# EAGLE design PowerSystem (EAGLE 7.2.0)

## Sheet 1 of 5
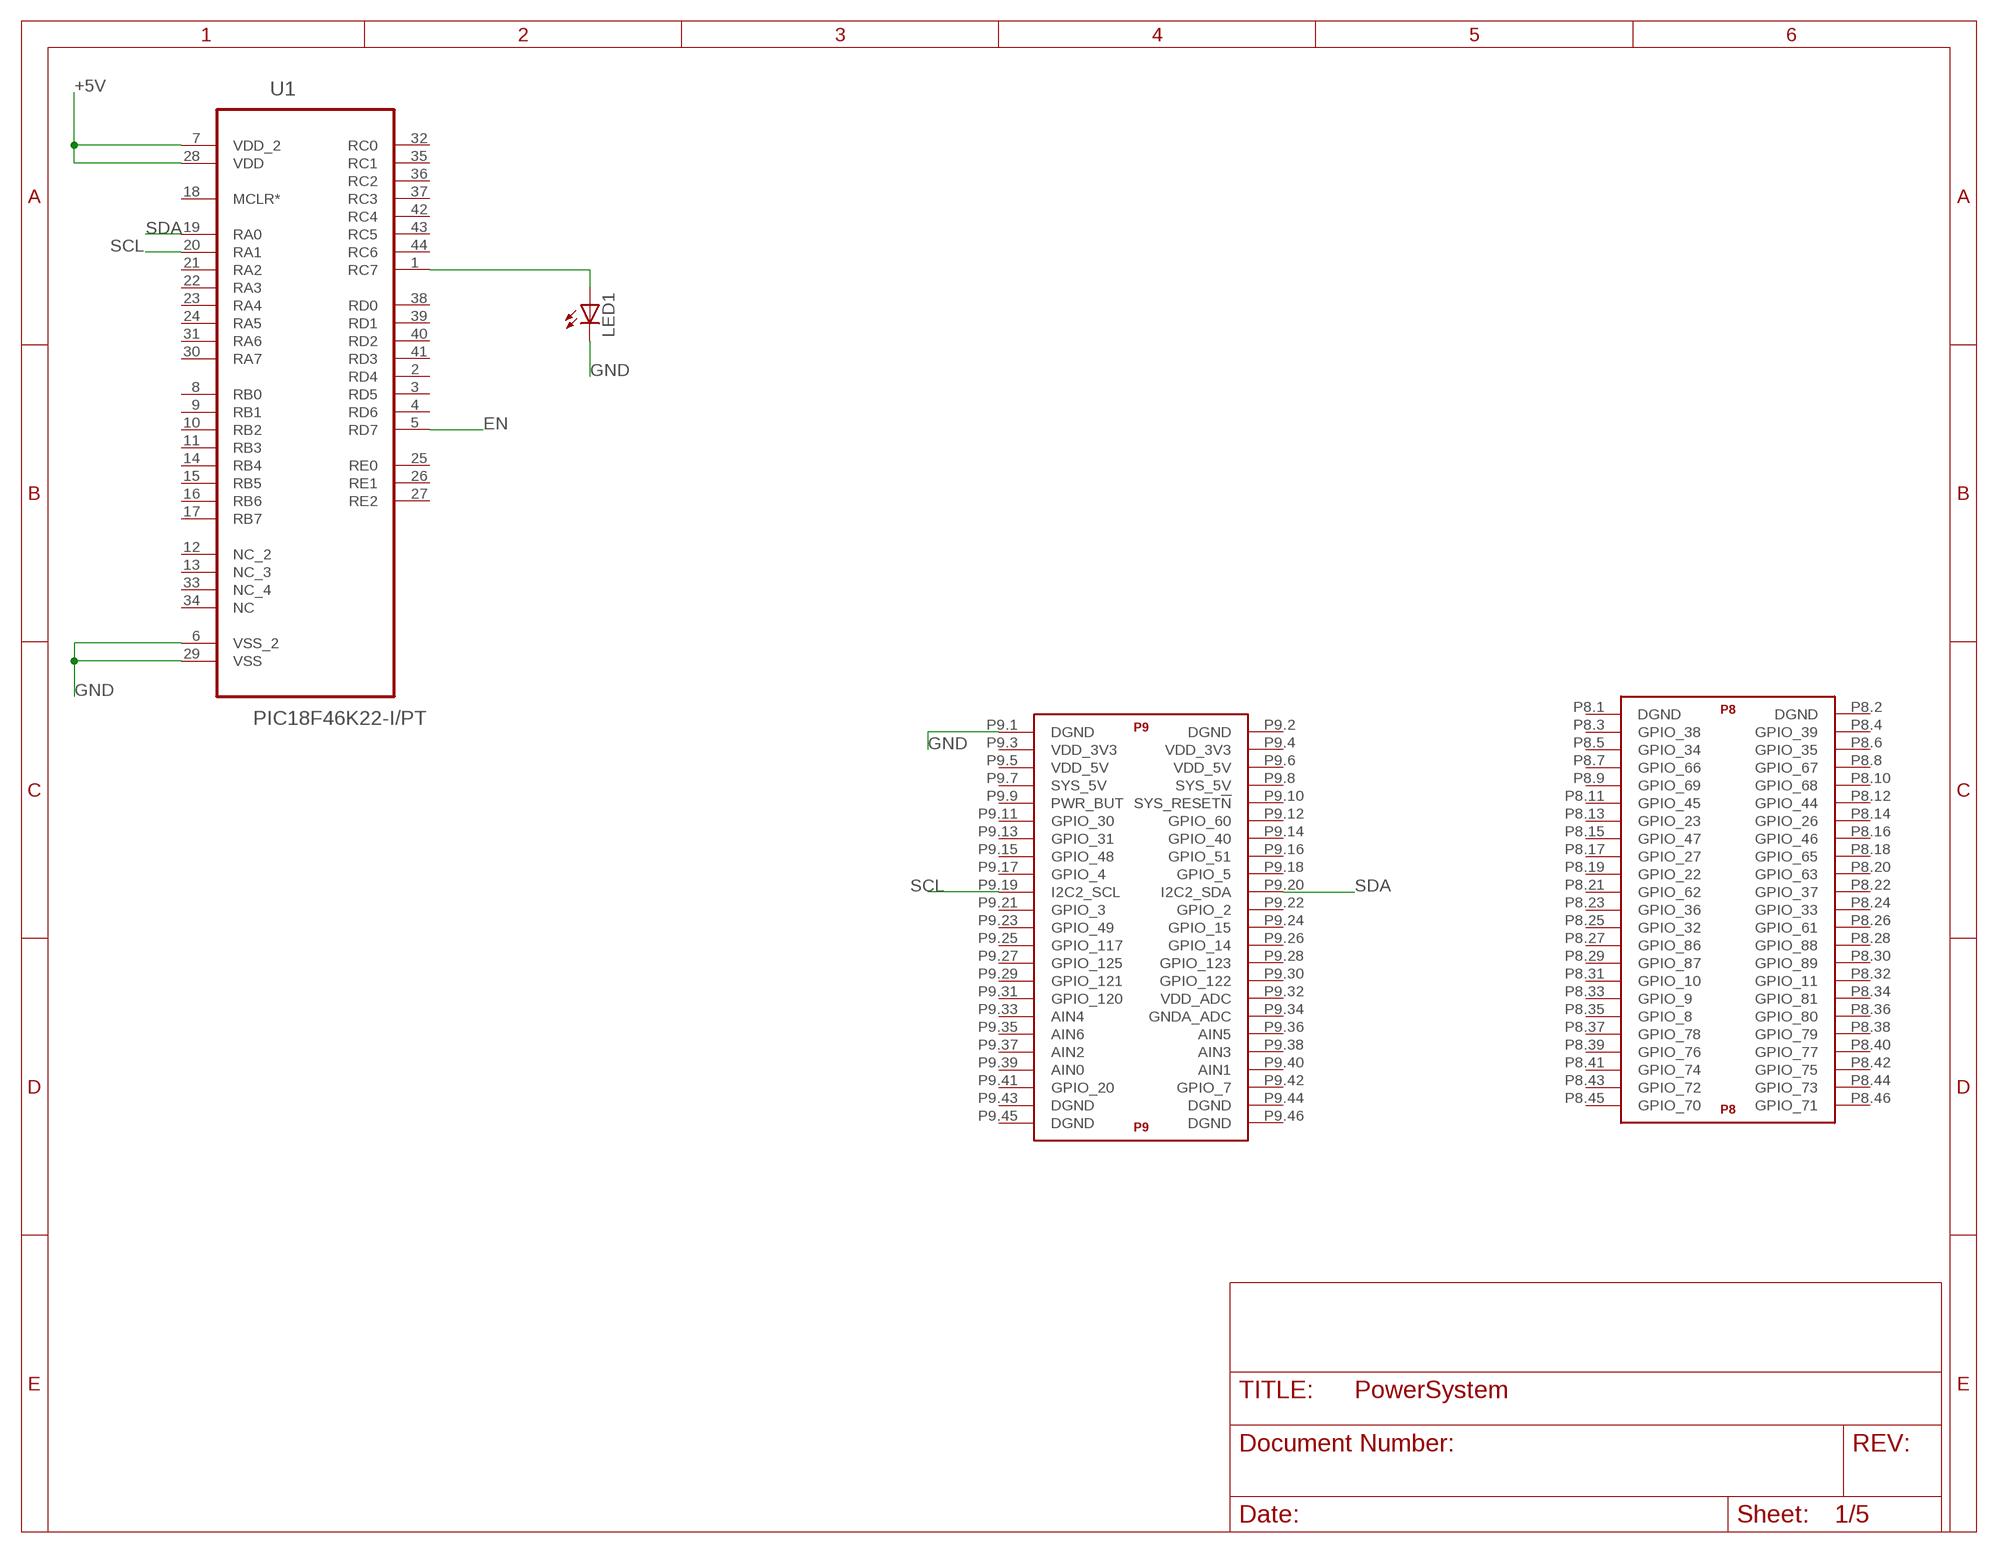
[diagram p0: schematic, sheet 1]

### Parts
LED1  LED  [SMARTLED-TTW]
U1  PIC18F46K22-I/PT  [QFP80P1200X1200X120-44N]
U$1  BEAGLE_BONE_BLACK_CAPE  [BEAGLE_BONE_BLACK_CAPE]

### Nets
+5V: U1.7(VDD_2) U1.28(VDD) ; also sheet 2
EN: U1.5(RD7) ; also sheet 4
GND: LED1.C@1(C) U1.6(VSS_2) U1.29(VSS) U$1.P9.1(P9:DGND) ; also sheet 2,4
N$5: LED1.A@1(A) U1.1(RC7)
SCL: U1.20(RA1) U$1.P9.19(P9:I2C2_SCL)
SDA: U1.19(RA0) U$1.P9.20(P9:I2C2_SDA)
Unconnected: U1.2(RD4) U1.3(RD5) U1.4(RD6) U1.8(RB0) U1.9(RB1) U1.10(RB2) U1.11(RB3) U1.12(NC_2) U1.13(NC_3) U1.14(RB4) U1.15(RB5) U1.16(RB6) U1.17(RB7) U1.18(MCLR*) U1.21(RA2) U1.22(RA3) U1.23(RA4) U1.24(RA5) U1.25(RE0) U1.26(RE1) U1.27(RE2) U1.30(RA7) U1.31(RA6) U1.32(RC0) U1.33(NC_4) U1.34(NC) U1.35(RC1) U1.36(RC2) U1.37(RC3) U1.38(RD0) U1.39(RD1) U1.40(RD2) U1.41(RD3) U1.42(RC4) U1.43(RC5) U1.44(RC6) U$1.P8.1(P8:DGND) U$1.P8.2(P8:DGND) U$1.P8.3(P8:GPIO_38) U$1.P8.4(P8:GPIO_39) U$1.P8.5(P8:GPIO_34) U$1.P8.6(P8:GPIO_35) U$1.P8.7(P8:GPIO_66) U$1.P8.8(P8:GPIO_67) U$1.P8.9(P8:GPIO_69) U$1.P8.10(P8:GPIO_68) U$1.P8.11(P8:GPIO_45) U$1.P8.12(P8:GPIO_44) U$1.P8.13(P8:GPIO_23) U$1.P8.14(P8:GPIO_26) U$1.P8.15(P8:GPIO_47) U$1.P8.16(P8:GPIO_46) U$1.P8.17(P8:GPIO_27) U$1.P8.18(P8:GPIO_65) U$1.P8.19(P8:GPIO_22) U$1.P8.20(P8:GPIO_63) U$1.P8.21(P8:GPIO_62) U$1.P8.22(P8:GPIO_37) U$1.P8.23(P8:GPIO_36) U$1.P8.24(P8:GPIO_33) U$1.P8.25(P8:GPIO_32) U$1.P8.26(P8:GPIO_61) U$1.P8.27(P8:GPIO_86) U$1.P8.28(P8:GPIO_88) U$1.P8.29(P8:GPIO_87) U$1.P8.30(P8:GPIO_89) U$1.P8.31(P8:GPIO_10) U$1.P8.32(P8:GPIO_11) U$1.P8.33(P8:GPIO_9) U$1.P8.34(P8:GPIO_81) U$1.P8.35(P8:GPIO_8) U$1.P8.36(P8:GPIO_80) U$1.P8.37(P8:GPIO_78) U$1.P8.38(P8:GPIO_79) U$1.P8.39(P8:GPIO_76) U$1.P8.40(P8:GPIO_77) U$1.P8.41(P8:GPIO_74) U$1.P8.42(P8:GPIO_75) U$1.P8.43(P8:GPIO_72) U$1.P8.44(P8:GPIO_73) U$1.P8.45(P8:GPIO_70) U$1.P8.46(P8:GPIO_71) U$1.P9.2(P9:DGND) U$1.P9.3(P9:VDD_3V3) U$1.P9.4(P9:VDD_3V3) U$1.P9.5(P9:VDD_5V) U$1.P9.6(P9:VDD_5V) U$1.P9.7(P9:SYS_5V) U$1.P9.8(P9:SYS_5V) U$1.P9.9(P9:PWR_BUT) U$1.P9.10(P9:SYS_RESET!N) U$1.P9.11(P9:GPIO_30) U$1.P9.12(P9:GPIO_60) U$1.P9.13(P9:GPIO_31) U$1.P9.14(P9:GPIO_40) U$1.P9.15(P9:GPIO_48) U$1.P9.16(P9:GPIO_51) U$1.P9.17(P9:GPIO_4) U$1.P9.18(P9:GPIO_5) U$1.P9.21(P9:GPIO_3) U$1.P9.22(P9:GPIO_2) U$1.P9.23(P9:GPIO_49) U$1.P9.24(P9:GPIO_15) U$1.P9.25(P9:GPIO_117) U$1.P9.26(P9:GPIO_14) U$1.P9.27(P9:GPIO_125) U$1.P9.28(P9:GPIO_123) U$1.P9.29(P9:GPIO_121) U$1.P9.30(P9:GPIO_122) U$1.P9.31(P9:GPIO_120) U$1.P9.32(P9:VDD_ADC) U$1.P9.33(P9:AIN4) U$1.P9.34(P9:GNDA_ADC) U$1.P9.35(P9:AIN6) U$1.P9.36(P9:AIN5) U$1.P9.37(P9:AIN2) U$1.P9.38(P9:AIN3) U$1.P9.39(P9:AIN0) U$1.P9.40(P9:AIN1) U$1.P9.41(P9:GPIO_20) U$1.P9.42(P9:GPIO_7) U$1.P9.43(P9:DGND) U$1.P9.44(P9:DGND) U$1.P9.45(P9:DGND) U$1.P9.46(P9:DGND)

## Sheet 2 of 5
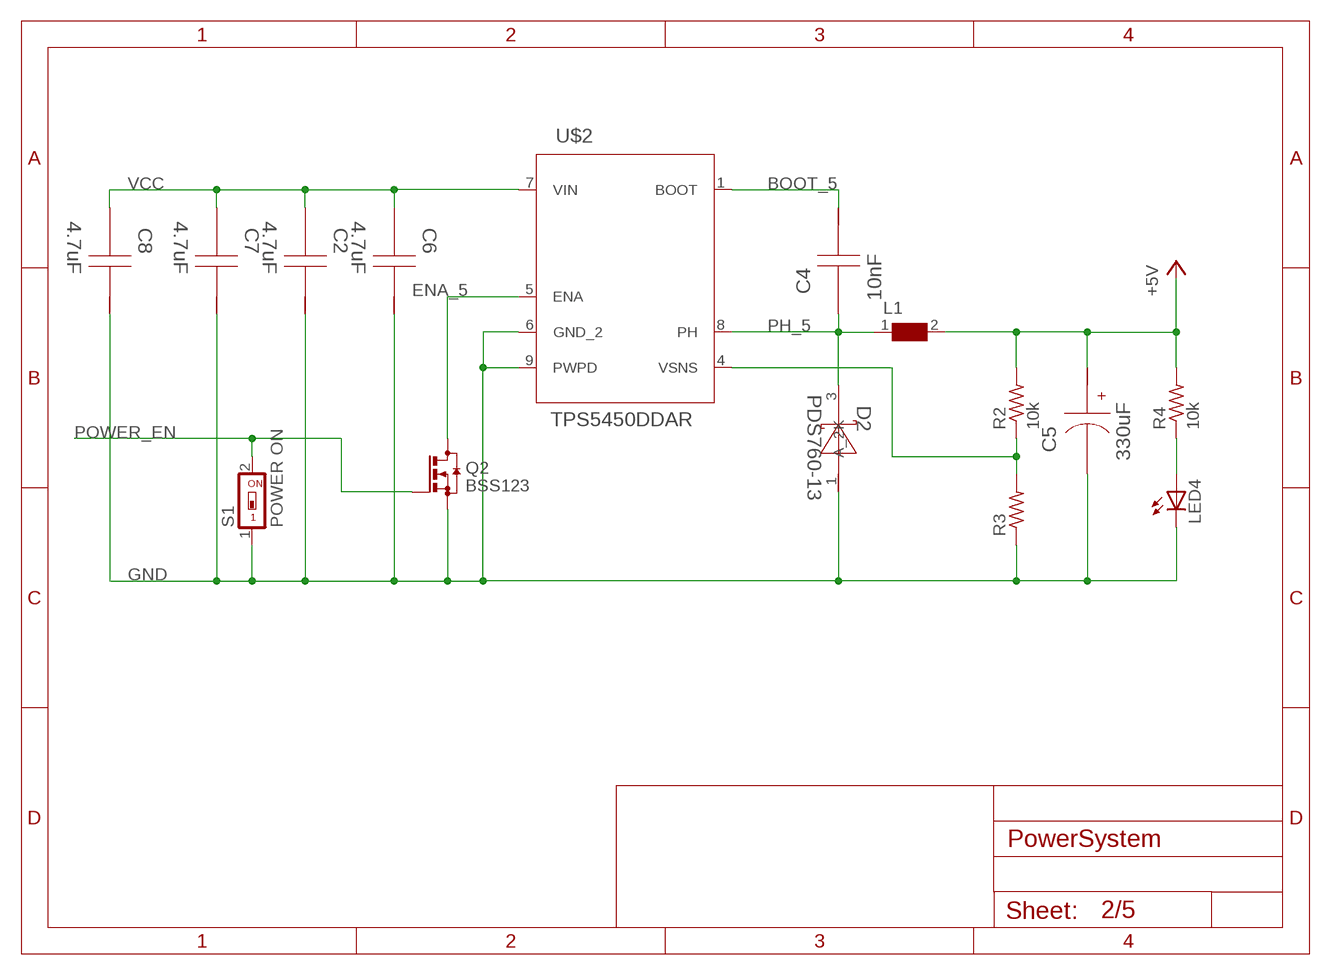
[diagram p1: schematic, sheet 2]

### Parts
C2  4.7uF  GRM31CR71H475KA12L  [1206]
C4  10nF  C0805C103K5RACTU  [0805]
C5  330uF  10SVP330MX  [SM_RADIAL_10AMM]
C6  4.7uF  GRM31CR71H475KA12L  [1206]
C7  4.7uF  GRM31CR71H475KA12L  [1206]
C8  4.7uF  GRM31CR71H475KA12L  [1206]
D2  PDS760-13  [POWERDI5]
L1  WE-HCC-7443331000_1090  [WE-HCC_1090]
LED4  LEDSML1206  [SML1206]
Q2  BSS123  [SOT23]
R2  10k  R-US_R1206  [R1206]
R3  R-US_R1206  [R1206]
R4  10k  R-US_R1206  [R1206]
S1  POWER ON  SWS001  [SMS-001]
U$2  TPS5450DDAR  [R-PDSO-G8]

### Nets
+5V: C5.1(+) L1.2 R2.2 R4.2 ; also sheet 1
BOOT_5: C4.1 U$2.1(BOOT)
ENA_5: Q2.3(D) U$2.5(ENA)
GND: C2.1 C5.2(-) C6.1 C7.1 C8.1 D2.1(A_2) LED4.C Q2.2(S) R3.1 S1.1 U$2.6(GND_2) U$2.9(PWPD) ; also sheet 1,4
N$2: LED4.A R4.1
PH_5: C4.2 D2.3(K) L1.1 U$2.8(PH)
POWER_EN: Q2.1(G) S1.2
VCC: C2.2 C6.2 C7.2 C8.2 U$2.7(VIN) ; also sheet 4
VSNS_5: R2.1 R3.2 U$2.4(VSNS)

## Sheet 3 of 5
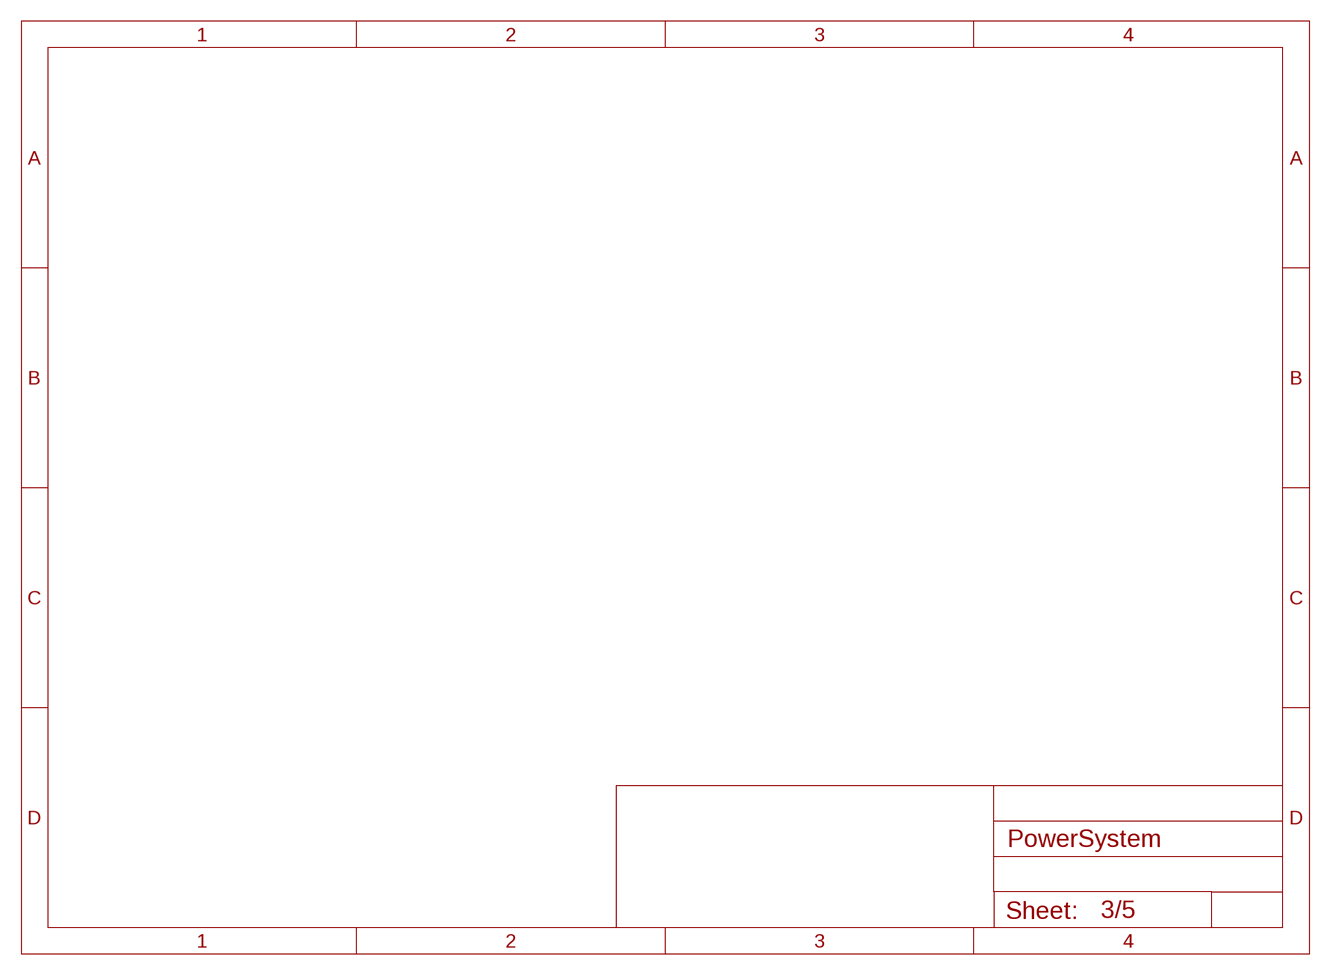
[diagram p2: schematic, sheet 3]

## Sheet 4 of 5
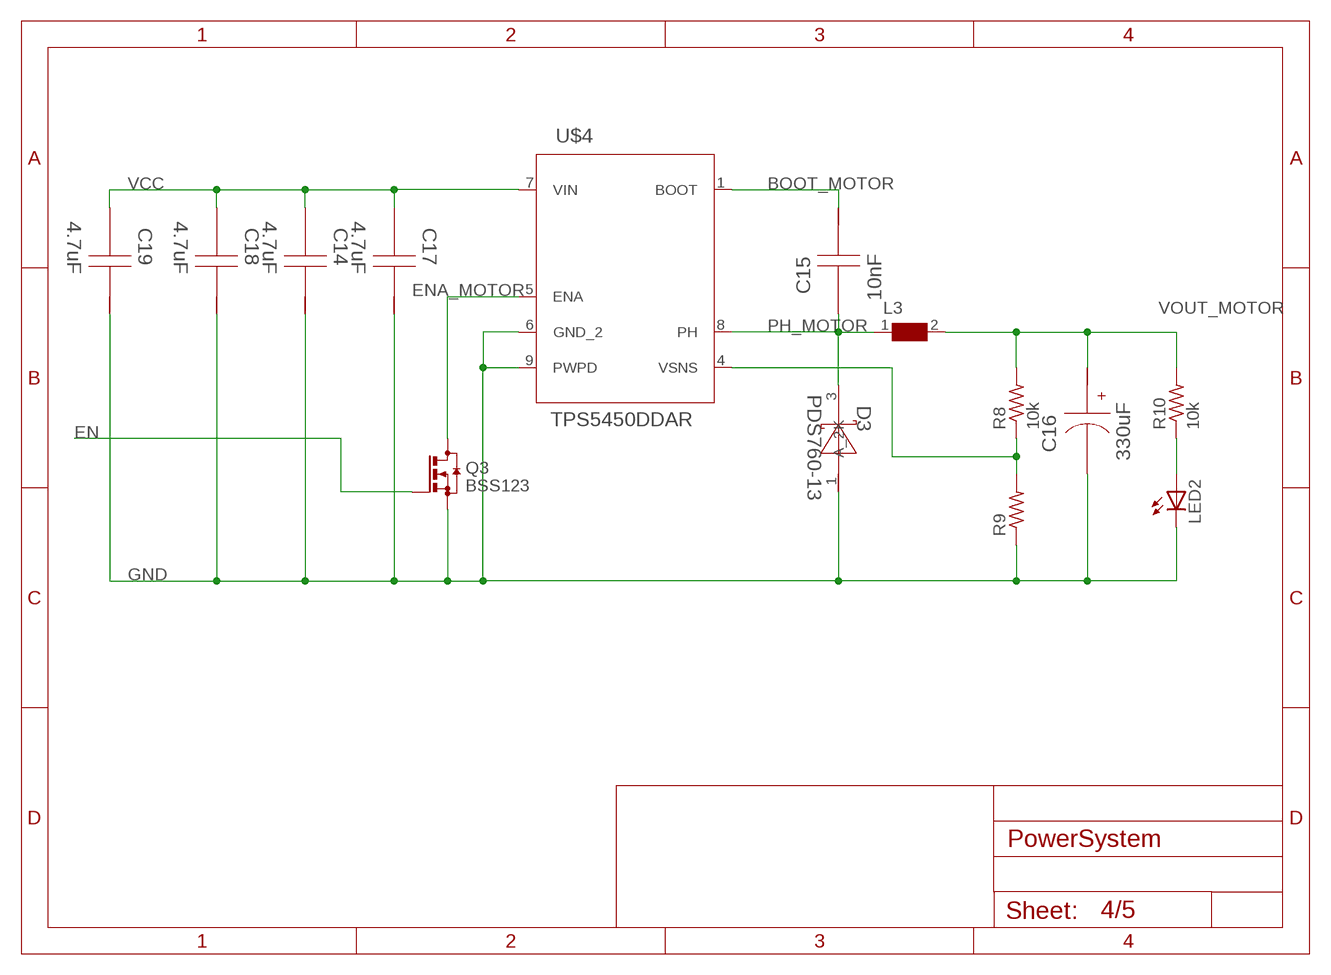
[diagram p3: schematic, sheet 4]

### Parts
C14  4.7uF  GRM31CR71H475KA12L  [1206]
C15  10nF  C0805C103K5RACTU  [0805]
C16  330uF  10SVP330MX  [SM_RADIAL_10AMM]
C17  4.7uF  GRM31CR71H475KA12L  [1206]
C18  4.7uF  GRM31CR71H475KA12L  [1206]
C19  4.7uF  GRM31CR71H475KA12L  [1206]
D3  PDS760-13  [POWERDI5]
L3  WE-HCC-7443331000_1090  [WE-HCC_1090]
LED2  LEDSML1206  [SML1206]
Q3  BSS123  [SOT23]
R8  10k  R-US_R1206  [R1206]
R9  R-US_R1206  [R1206]
R10  10k  R-US_R1206  [R1206]
U$4  TPS5450DDAR  [R-PDSO-G8]

### Nets
BOOT_MOTOR: C15.1 U$4.1(BOOT)
EN: Q3.1(G) ; also sheet 1
ENA_MOTOR: Q3.3(D) U$4.5(ENA)
GND: C14.1 C16.2(-) C17.1 C18.1 C19.1 D3.1(A_2) LED2.C Q3.2(S) R9.1 U$4.6(GND_2) U$4.9(PWPD) ; also sheet 1,2
N$4: LED2.A R10.1
PH_MOTOR: C15.2 D3.3(K) L3.1 U$4.8(PH)
VCC: C14.2 C17.2 C18.2 C19.2 U$4.7(VIN) ; also sheet 2
VOUT_MOTOR: C16.1(+) L3.2 R8.2 R10.2
VSNS1_MOTOR: R8.1 R9.2 U$4.4(VSNS)

## Sheet 5 of 5
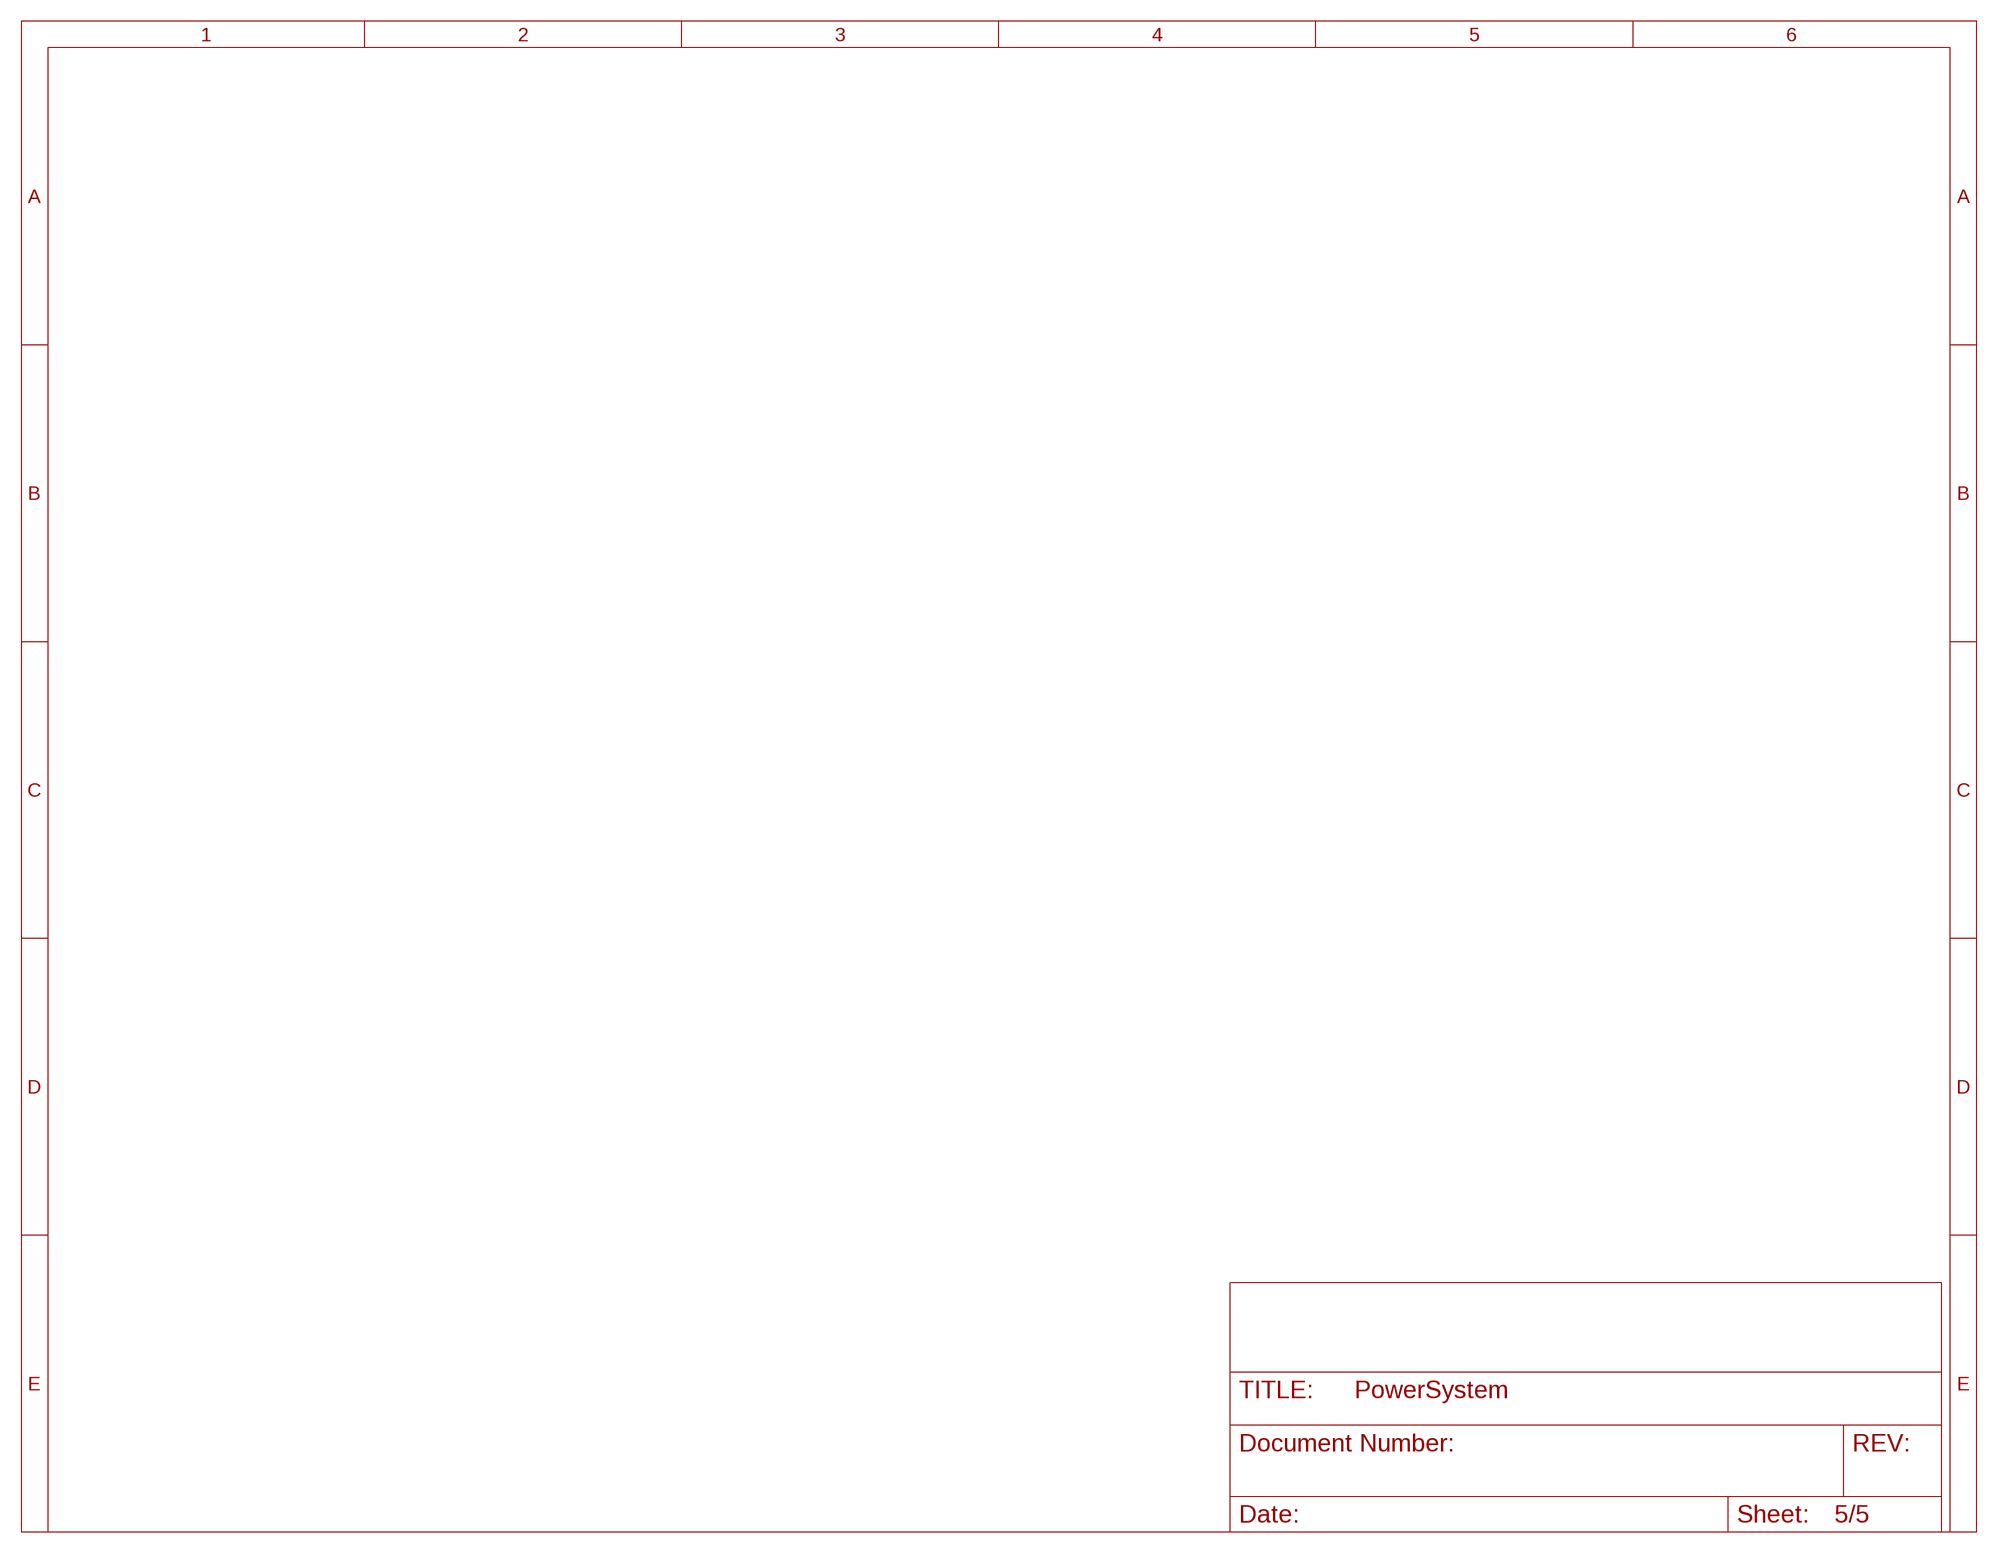
[diagram p4: schematic, sheet 5]

## Library data of the parts
C2 C6-C8 C14 C17-C19 = 5v:GRM31CR71H475KA12L; CAP: 4.7E-6; ESR: 0.0; IRMS: 0.0; MANUFACTURER_NAME: MuRata; MANUFACTURER_PART_NUMBER: GRM31CR71H475KA12L; VDC: 50.0; VENDOR: MuRata
C4 C15 = 5v:C0805C103K5RACTU; CAP: 1.0E-8; ESR: 1.739; IRMS: 0.411; MANUFACTURER_NAME: Kemet; MANUFACTURER_PART_NUMBER: C0805C103K5RACTU; VDC: 50.0; VENDOR: Kemet
C5 C16 = 5v:10SVP330MX; CAP: 3.3E-4; DATASHEETURL: http://www.edc.sanyo.com/english/pdf/oscon/E32.pdf; ESR: 0.025; IRMS: 3.7; MANUFACTURER_NAME: Panasonic; MANUFACTURER_PART_NUMBER: 10SVP330MX; VDC: 10.0; VENDOR: Panasonic
D2 D3 = 5v:PDS760-13; DATASHEETURL: www.diodes.com/datasheets/ds30477.pdf; IO: 7.0; MANUFACTURER_NAME: Diodes Inc.; MANUFACTURER_PART_NUMBER: PDS760-13; VENDOR: Diodes Inc.; VFATIO: 0.56; VRRM: 60.0
L1 L3 = WE-HCC:WE-HCC: SMD High Current Cube Inductor WE-HCC - magnetically shieled - current capability up to 27A - excellent saturation characteristics -- filter choke for DC/DC converter -- single and polyphase buck converter -- filter choke for motor electronics; MPN: 7443331000; OC_FARNELL: 1848254; OC_NEWARK: 13T9771; PACKAGE: 1090; SUPPLIER: Wuerth Elektronik
LED1 = Parts4Class:LED: LED OSRAM: - CHIPLED LG R971, LG N971, LY N971, LG Q971, LY Q971, LO R971, LY R971 LH N974, LH R974 LS Q976, LO Q976, LY Q976 LO Q996 - Hyper CHIPLED LW Q18S LB Q993, LB Q99A, LB R99A - SideLED LS A670, LO A670, LY A670, LG A670, LP A670 LB A673, LV A673, LT A673, LW A673 LH A674 LY A675 LS A676, LA A676, LO A676, LY A676, LW A676 LS A679, LY A679, LG A679 - Hyper Micro SIDELED® LS Y876, LA Y876, LO Y876, LY Y876 LT Y87S - SmartLED LW L88C, LW L88S LB L89C, LB L89S, LG L890 LS L89K, LO L89K, LY L89K LS L896, LA L896, LO L896, LY L896 - TOPLED LS T670, LO T670, LY T670, LG T670, LP T670 LSG T670, LSP T670, LSY T670, LOP T670, LYG T670 LG T671, LOG T671, LSG T671 LB T673, LV T673, LT T673, LW T673 LH T674 LS T676, LA T676, LO T676, LY T676, LB T676, LH T676, LSB T676, LW T676 LB T67C, LV T67C, LT T67C, LS T67K, LO T67K, LY T67K, LW E67C LS E67B, LA E67B, LO E67B, LY E67B, LB E67C, LV E67C, LT E67C LW T67C LS T679, LY T679, LG T679 LS T770, LO T770, LY T770, LG T770, LP T770 LB T773, LV T773, LT T773, LW T773 LH T774 LS E675, LA E675, LY E675, LS T675 LS T776, LA T776, LO T776, LY T776, LB T776 LHGB T686 LT T68C, LB T68C - Hyper Mini TOPLED® LB M676 - Mini TOPLED Santana® LG M470 LS M47K, LO M47K, LY M47K Source: http://www.osram.convergy.de LUXEON: - LUMILED® LXK2-PW12-R00, LXK2-PW12-S00, LXK2-PW14-U00, LXK2-PW14-V00 LXK2-PM12-R00, LXK2-PM12-S00, LXK2-PM14-U00 LXK2-PE12-Q00, LXK2-PE12-R00, LXK2-PE12-S00, LXK2-PE14-T00, LXK2-PE14-U00 LXK2-PB12-K00, LXK2-PB12-L00, LXK2-PB12-M00, LXK2-PB14-N00, LXK2-PB14-P00, LXK2-PB14-Q00 LXK2-PR12-L00, LXK2-PR12-M00, LXK2-PR14-Q00, LXK2-PR14-R00 LXK2-PD12-Q00, LXK2-PD12-R00, LXK2-PD12-S00 LXK2-PH12-R00, LXK2-PH12-S00 LXK2-PL12-P00, LXK2-PL12-Q00, LXK2-PL12-R00 Source: www.luxeon.com KINGBRIGHT: KA-3528ASYC Source: www.kingbright.com
LED2 LED4 = led:LED: LED OSRAM: - CHIPLED LG R971, LG N971, LY N971, LG Q971, LY Q971, LO R971, LY R971 LH N974, LH R974 LS Q976, LO Q976, LY Q976 LO Q996 - Hyper CHIPLED LW Q18S LB Q993, LB Q99A, LB R99A - SideLED LS A670, LO A670, LY A670, LG A670, LP A670 LB A673, LV A673, LT A673, LW A673 LH A674 LY A675 LS A676, LA A676, LO A676, LY A676, LW A676 LS A679, LY A679, LG A679 - Hyper Micro SIDELED® LS Y876, LA Y876, LO Y876, LY Y876 LT Y87S - SmartLED LW L88C, LW L88S LB L89C, LB L89S, LG L890 LS L89K, LO L89K, LY L89K LS L896, LA L896, LO L896, LY L896 - TOPLED LS T670, LO T670, LY T670, LG T670, LP T670 LSG T670, LSP T670, LSY T670, LOP T670, LYG T670 LG T671, LOG T671, LSG T671 LB T673, LV T673, LT T673, LW T673 LH T674 LS T676, LA T676, LO T676, LY T676, LB T676, LH T676, LSB T676, LW T676 LB T67C, LV T67C, LT T67C, LS T67K, LO T67K, LY T67K, LW E67C LS E67B, LA E67B, LO E67B, LY E67B, LB E67C, LV E67C, LT E67C LW T67C LS T679, LY T679, LG T679 LS T770, LO T770, LY T770, LG T770, LP T770 LB T773, LV T773, LT T773, LW T773 LH T774 LS E675, LA E675, LY E675, LS T675 LS T776, LA T776, LO T776, LY T776, LB T776 LHGB T686 LT T68C, LB T68C - Hyper Mini TOPLED® LB M676 - Mini TOPLED Santana® LG M470 LS M47K, LO M47K, LY M47K Source: http://www.osram.convergy.de LUXEON: - LUMILED® LXK2-PW12-R00, LXK2-PW12-S00, LXK2-PW14-U00, LXK2-PW14-V00 LXK2-PM12-R00, LXK2-PM12-S00, LXK2-PM14-U00 LXK2-PE12-Q00, LXK2-PE12-R00, LXK2-PE12-S00, LXK2-PE14-T00, LXK2-PE14-U00 LXK2-PB12-K00, LXK2-PB12-L00, LXK2-PB12-M00, LXK2-PB14-N00, LXK2-PB14-P00, LXK2-PB14-Q00 LXK2-PR12-L00, LXK2-PR12-M00, LXK2-PR14-Q00, LXK2-PR14-R00 LXK2-PD12-Q00, LXK2-PD12-R00, LXK2-PD12-S00 LXK2-PH12-R00, LXK2-PH12-S00 LXK2-PL12-P00, LXK2-PL12-Q00, LXK2-PL12-R00 Source: www.luxeon.com KINGBRIGHT: KA-3528ASYC Source: www.kingbright.com
Q2 Q3 = transistor-small-signal:BSS123: N-CHANNEL MOS FET
R2-R4 R8-R10 = rcl:R-US_: RESISTOR, American symbol
S1 = smd-special:SWS001: SMD Dip Switch 1 pol.
U1 = Parts4Class:PIC18F46K22-I/PT: IC PIC MCU 64KB FLASH 44TQFP; MPN: PIC18F46K22-I/PT; OC_FARNELL: 1814980; OC_NEWARK: 65R6013; PACKAGE: TQFP-44; SUPPLIER: Microchip
U$1 = Parts4Class:BEAGLE_BONE_BLACK_CAPE
U$2 U$4 = 5v:TPS5450DDAR; DATASHEETURL: http://www.ti.com/product/tps5450; FREQUENCY: 500000.0; IMAX: 5.0; MANUFACTURER_NAME: Texas Instruments; MANUFACTURER_PART_NUMBER: TPS5450DDA; MKTG_PACKAGE: TPS5450; NSID: TPS5450DDAR; PACKAGE: TPS5450; VENDOR: Texas Instruments

## Board
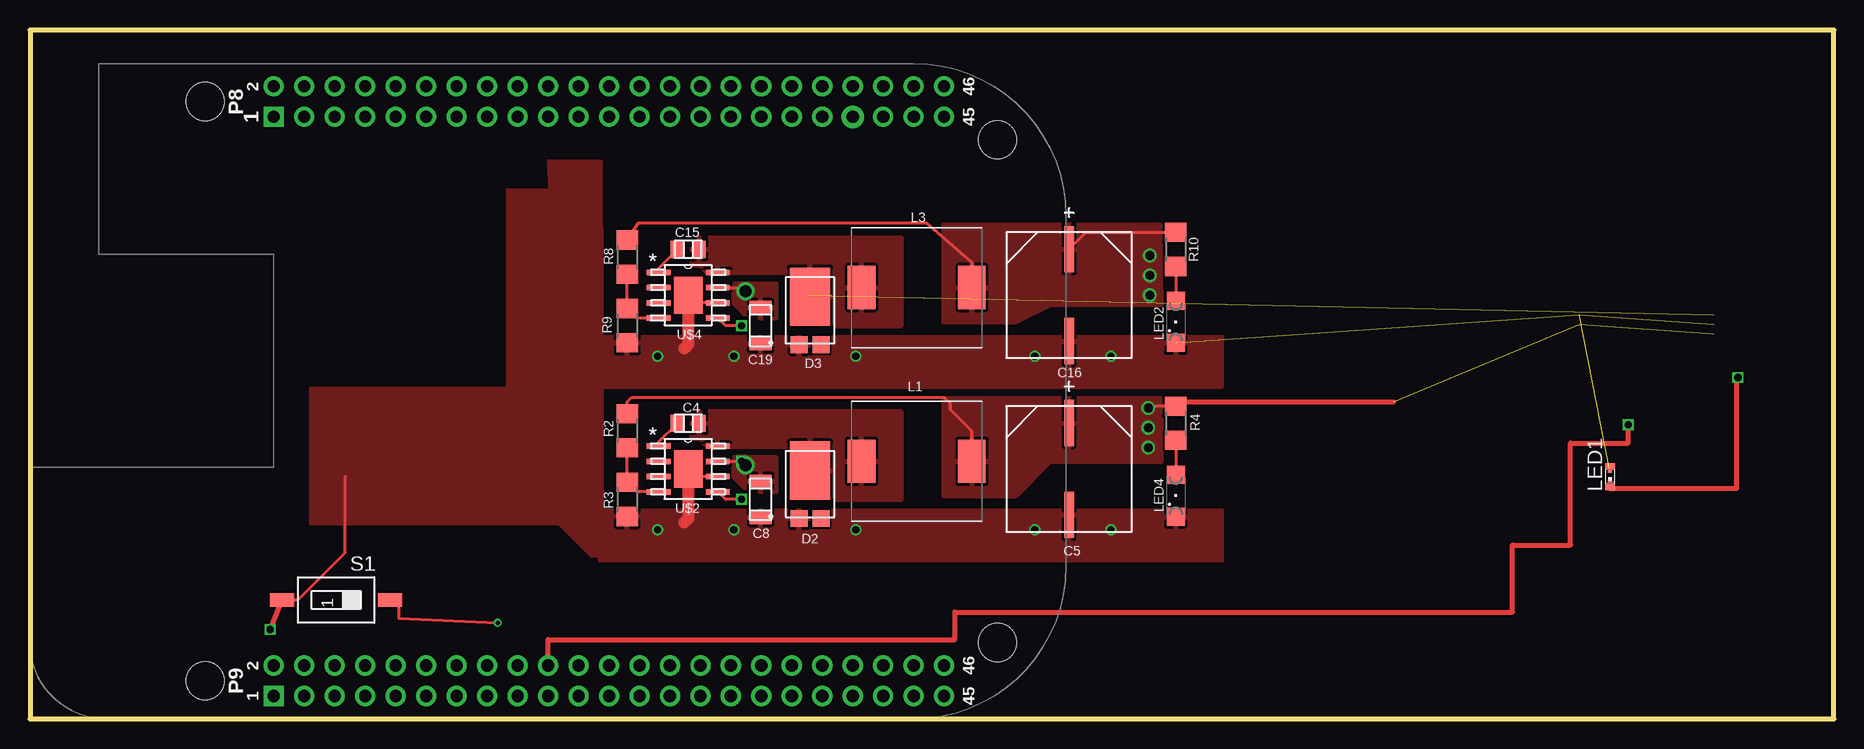
[diagram p5: board, top side]
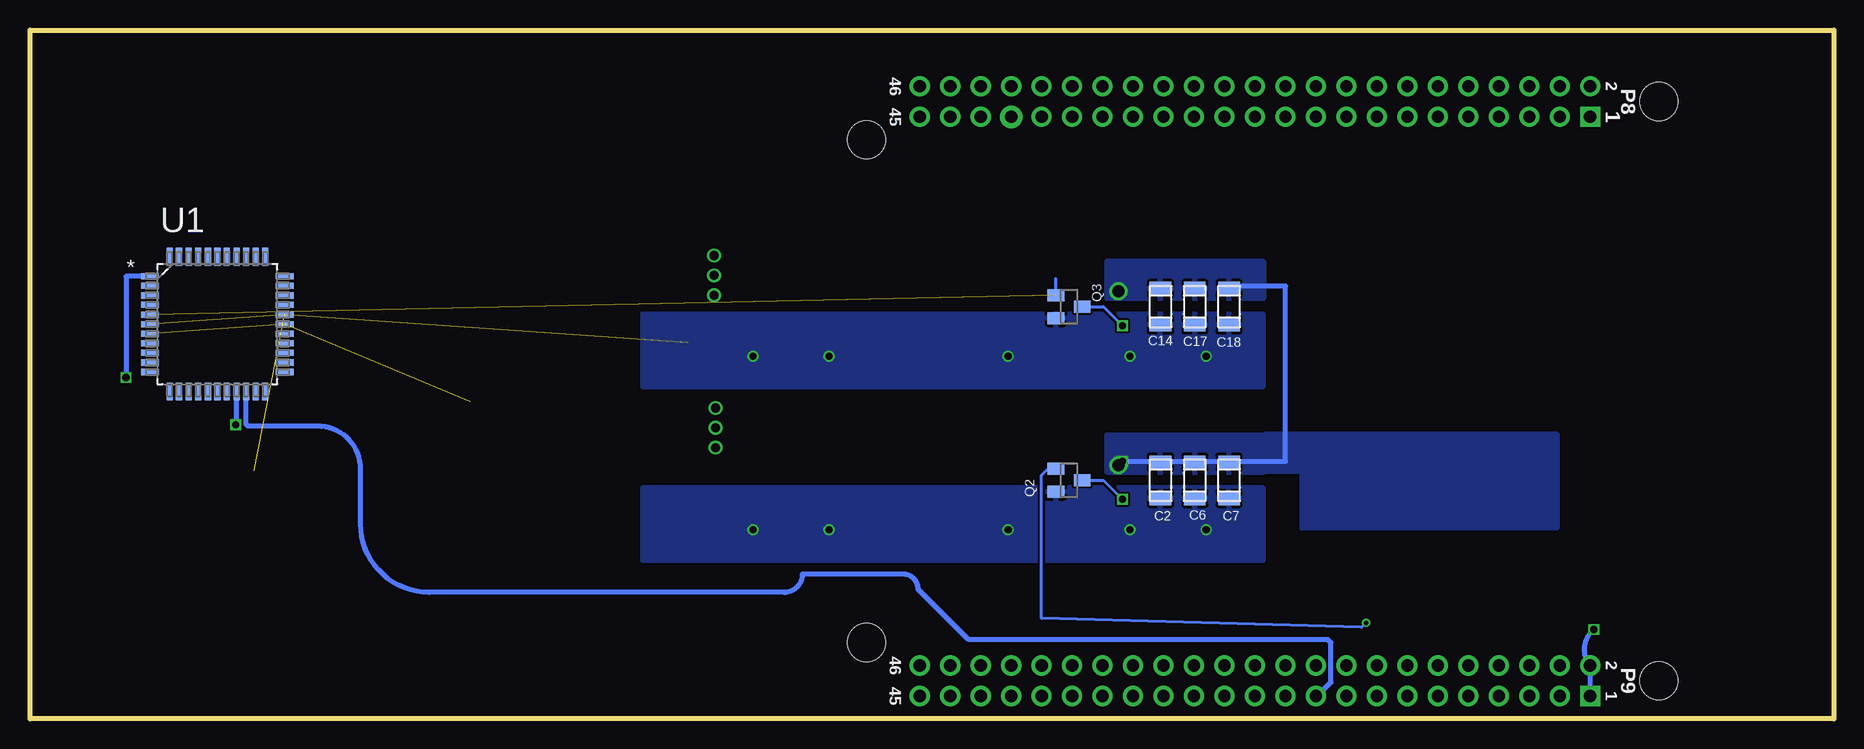
[diagram p6: board, bottom side, seen from below]

Size 150.37 x 57.4 mm. Coordinates in mm from the lower left corner, seen from the top.
Outline: 0,0 150.37,0 150.37,57.4 0,57.4 0,0
Copper layers (1*16): Top 0.035mm / dielectric 1.5mm / Bottom 0.035mm
Design rules "EagleRules": minimum track width 7mil, minimum drill 12mil, track to track 7mil, track to pad 7mil, pad to pad 7mil, via to via 7mil, smd to smd 0mil, copper to edge 20mil, drill to drill 10mil, minimum pad ring 10mil, minimum via ring 6mil, stop-mask expansion 2mil, vias tented up to drill 25mil, thermal gap 10mil

### Footprints (pad centres in the part's own frame; a part is rotated, then mirrored left to right if it is on the bottom)
1206 = smd 1.118 x 1.803: 1 -1.499,0; 2 1.499,0
0805 = smd 1.118 x 1.448: 1 -0.902,0; 2 0.902,0
SM_RADIAL_10AMM = smd 3.861 x 0.787: 1 -3.823,0; 2 3.823,0
POWERDI5 = smd 1.397 x 1.397: 1 -0.92,-2.857; 2 0.92,-2.857 | smd 3.353 x 4.851: 3 0,1.13
WE-HCC_1090 = smd 2.3 x 3.6: 1 -4.6,0; 2 4.6,0
SMARTLED-TTW = smd 0.8 x 0.5: A 0,-0.875; C 0,0.875 | smd 0.35 x 0.35: A@1 0,-0.5; C@1 0,0.5
SML1206 = smd 1.5 x 1.5: A 1.75,0; C -1.75,0
SOT23 = smd 1 x 1.4: 1 -0.95,-1.1; 2 0.95,-1.1; 3 0,1.1
R1206 = smd 1.6 x 1.803: 1 -1.422,0; 2 1.422,0
SMS-001 = smd 1.092 x 2.007: 1 0,-4.496; 2 0,4.496
QFP80P1200X1200X120-44N = smd 1.473 x 0.508: 1 -5.613,3.988; 2 -5.613,3.2; 3 -5.613,2.388; 4 -5.613,1.6; 5 -5.613,0.787; 6 -5.613,0; 7 -5.613,-0.787; 8 -5.613,-1.6; 9 -5.613,-2.388; 10 -5.613,-3.2; 11 -5.613,-3.988; 23 5.613,-3.988; 24 5.613,-3.2; 25 5.613,-2.388; 26 5.613,-1.6; 27 5.613,-0.787; 28 5.613,0; 29 5.613,0.787; 30 5.613,1.6; 31 5.613,2.388; 32 5.613,3.2; 33 5.613,3.988 | smd 0.508 x 1.473: 12 -3.988,-5.613; 13 -3.2,-5.613; 14 -2.388,-5.613; 15 -1.6,-5.613; 16 -0.787,-5.613; 17 0,-5.613; 18 0.787,-5.613; 19 1.6,-5.613; 20 2.388,-5.613; 21 3.2,-5.613; 22 3.988,-5.613; 34 3.988,5.613; 35 3.2,5.613; 36 2.388,5.613; 37 1.6,5.613; 38 0.787,5.613; 39 0,5.613; 40 -0.787,5.613; 41 -1.6,5.613; 42 -2.388,5.613; 43 -3.2,5.613; 44 -3.988,5.613
BEAGLE_BONE_BLACK_CAPE = drill 1.016 pad 1.676 square: P8.1 20.32,50.165; P9.1 20.32,1.905 | drill 1.016 pad 1.676: P8.2 20.32,52.705; P8.3 22.86,50.165; P8.4 22.86,52.705; P8.5 25.4,50.165; P8.6 25.4,52.705; P8.7 27.94,50.165; P8.8 27.94,52.705; P8.9 30.48,50.165; P8.10 30.48,52.705; P8.11 33.02,50.165; P8.12 33.02,52.705; P8.13 35.56,50.165; P8.14 35.56,52.705; P8.15 38.1,50.165; P8.16 38.1,52.705; P8.17 40.64,50.165; P8.18 40.64,52.705; P8.19 43.18,50.165; P8.20 43.18,52.705; P8.21 45.72,50.165; P8.22 45.72,52.705; P8.23 48.26,50.165; P8.24 48.26,52.705; P8.25 50.8,50.165; P8.26 50.8,52.705; P8.27 53.34,50.165; P8.28 53.34,52.705; P8.29 55.88,50.165; P8.30 55.88,52.705; P8.31 58.42,50.165; P8.32 58.42,52.705; P8.33 60.96,50.165; P8.34 60.96,52.705; P8.35 63.5,50.165; P8.36 63.5,52.705; P8.37 66.04,50.165; P8.38 66.04,52.705; P8.40 68.58,52.705; P8.41 71.12,50.165; P8.42 71.12,52.705; P8.43 73.66,50.165; P8.44 73.66,52.705; P8.45 76.2,50.165; P8.46 76.2,52.705; P9.2 20.32,4.445; P9.3 22.86,1.905; P9.4 22.86,4.445; P9.5 25.4,1.905; P9.6 25.4,4.445; P9.7 27.94,1.905; P9.8 27.94,4.445; P9.9 30.48,1.905; P9.10 30.48,4.445; P9.11 33.02,1.905; P9.12 33.02,4.445; P9.13 35.56,1.905; P9.14 35.56,4.445; P9.15 38.1,1.905; P9.16 38.1,4.445; P9.17 40.64,1.905; P9.18 40.64,4.445; P9.19 43.18,1.905; P9.20 43.18,4.445; P9.21 45.72,1.905; P9.22 45.72,4.445; P9.23 48.26,1.905; P9.24 48.26,4.445; P9.25 50.8,1.905; P9.26 50.8,4.445; P9.27 53.34,1.905; P9.28 53.34,4.445; P9.29 55.88,1.905; P9.30 55.88,4.445; P9.31 58.42,1.905; P9.32 58.42,4.445; P9.33 60.96,1.905; P9.34 60.96,4.445; P9.35 63.5,1.905; P9.36 63.5,4.445; P9.37 66.04,1.905; P9.38 66.04,4.445; P9.39 68.58,1.905; P9.40 68.58,4.445; P9.41 71.12,1.905; P9.42 71.12,4.445; P9.43 73.66,1.905; P9.44 73.66,4.445; P9.45 76.2,1.905; P9.46 76.2,4.445 | drill 1.016 pad 1.88: P8.39 68.58,50.165 | hole 3.175: 14.605,3.175; 80.645,6.35; 80.645,48.26; 14.605,51.435
R-PDSO-G8 = smd 1.981 x 0.457: 1 -2.464,1.905; 2 -2.464,0.635; 3 -2.464,-0.635; 4 -2.464,-1.905; 5 2.464,-1.905; 6 2.464,-0.635; 7 2.464,0.635; 8 2.464,1.905 | smd 2.388 x 3.099: 9 0,0

### Placement (x,y rotation side)
C2  56.13,19.88 90 bottom
C4  54.86,24.64 0 top
C5  86.61,20.83 270 top
C6  53.28,19.88 90 bottom
C7  50.42,19.88 90 bottom
C8  60.9,18.29 90 top
C14  56.13,34.35 90 bottom
C15  54.86,39.12 0 top
C16  86.61,35.31 270 top
C17  53.28,34.35 90 bottom
C18  50.42,34.35 90 bottom
C19  60.9,32.77 90 top
D2  65.02,19.56 0 top
D3  65.02,34.04 0 top
L1  73.91,21.46 0 top
L3  73.91,35.94 0 top
LED1  131.7,20.19 0 top
LED2  95.5,33.08 90 top
LED4  95.5,18.61 90 top
Q2  63.75,19.88 270 bottom
Q3  63.75,34.35 270 bottom
R2  49.78,24 90 top
R3  49.78,18.29 90 top
R4  95.5,24.64 90 top
R8  49.78,38.48 90 top
R9  49.78,32.77 90 top
R10  95.5,39.12 90 top
S1  25.53,9.91 270 top
U1  134.75,32.89 0 bottom
U$1  0,0 0 top
U$2  54.86,20.83 0 top
U$4  54.86,35.31 0 top

### Tracks (layer width: path | path; a pad name or v marks a point on that pad's centre or on a via)
+5V  (via drill 0.76)  (2 unrouted)
  Top 0.254: R2.2 49.78,26.42 50.17,26.8 76.2,26.8 76.71,26.29 76.71,25.78 78.49,24 78.49,21.49 L1.2 | R4.2 93.88,26.06 v93.22,25.91
  Top 0.406: R4.2 arc-90 95.86,26.42 113.67,26.42
  other vias: 93.22,24.26 93.22,22.61
  pour Top: 76.14,26.67 76.14,18.61 82.17,18.61 85.03,21.46 94.3,21.46 94.3,26.67
BOOT_5
  Top 0.254: U$2.1 52.4,23.08 C4.1
BOOT_MOTOR
  Top 0.254: U$4.1 52.4,37.55 C15.1
EN  (1 unrouted)
  Bottom 0.254: Q3.1 64.85,36.7
ENA_5  (via drill 0.6)
  Top 0.254: v59.31,18.29 57.96,18.29 U$2.5
  Bottom 0.254: Q2.3 60.9,19.88 v59.31,18.29
ENA_MOTOR  (via drill 0.6)
  Top 0.254: v59.31,32.77 57.96,32.77 U$4.5
  Bottom 0.254: Q3.3 60.9,34.35 v59.31,32.77
GND  (via drill 0.6)  (3 unrouted)
  Top 0.254: U$2.6 54.86,20.19 | U$4.6 54.86,34.67 | S1.1 22.35,9.91 26.29,13.84 26.29,20.19
  Top 0.406: v20.02,7.44 S1.1
  Top 1.016: U$2.9 54.86,20.19 54.86,16.7 54.55,16.38 | U$4.9 54.86,34.67 54.86,31.18 54.55,30.86
  Bottom 0.406: U$1.P9.1 20.32,4.45 arc90 v20.02,7.44
  other vias: 52.32,15.75 58.67,15.75 68.83,15.75 83.76,15.75 90.11,15.75 52.32,30.23 58.67,30.23 68.83,30.23 83.76,30.23 90.11,30.23
  pour Bottom: 47.56,19.24 99.31,19.24 99.31,13.21 47.56,13.21
  pour Top: 47.56,17.34 99.31,17.34 99.31,13.21 47.56,13.21
  pour Bottom: 47.56,33.72 99.31,33.72 99.31,27.69 47.56,27.69
  pour Top: 47.56,31.81 99.31,31.81 99.31,27.69 47.56,27.69
  pour Top: 23.37,16.26 44.07,16.26 46.74,13.59 47.75,13.59 47.62,46.48 43.18,46.48 43.31,44.07 39.75,44.07 39.75,27.56 23.37,27.56
N$2
  Top 0.254: R4.1 LED4.A
N$4
  Top 0.254: R10.1 LED2.A
N$5  (via drill 0.6)
  Top 0.406: v142.37,28.45 142.24,28.45 142.24,19.18 131.7,19.18 LED1.A@1
  Bottom 0.406: U1.1 142.37,36.88 v142.37,28.45
PH_5
  pour Top: 55.18,25.59 55.18,23.37 55.82,23.37 56.45,22.73 63.12,22.73 66.29,18.29 72.64,18.29 72.64,25.59
PH_MOTOR
  pour Top: 55.18,40.07 55.18,37.85 55.82,37.85 56.45,37.21 63.12,37.21 66.29,32.77 72.64,32.77 72.64,40.07
POWER_EN  (via drill 0.38)
  Top 0.254: S1.2 30.73,9.91 30.73,8.38 v38.99,8
  Bottom 0.254: v38.99,8 39.37,7.62 66.04,8.38 66.04,20.32 65.53,20.83 Q2.1
SCL
  Bottom 0.406: U$1.P9.19 43.05,1.91 41.91,3.05 41.91,6.35 42.16,6.6 72.14,6.6 76.33,10.8 arc-90 77.6,12.06 85.98,12.06 arc90 87.5,10.54 117.09,10.54 arc90 122.81,16.26 122.81,20.83 arc-90 126.36,24.38 132.08,24.38 arc90 132.36,24.66 U1.20
SDA  (via drill 0.6)
  Top 0.406: U$1.P9.20 43.18,6.6 77.09,6.6 77.09,8.89 123.57,8.89 123.57,14.48 128.4,14.48 128.4,22.99 133.22,22.99 v133.22,24.51
  Bottom 0.406: v133.22,24.51 133.15,24.51 U1.19
VCC  (via drill 0.6, 1)
  Top 0.254: U$2.7 v59.31,21.46 v59.63,21.14 | U$4.7 59.31,35.94 v59.63,35.62
  Bottom 0.406: v59.31,21.46 45.72,21.46 45.72,36.07 50.42,36.07 C18.2
  pour Bottom: 47.56,20.51 60.58,20.51 60.58,23.69 47.56,23.69
  pour Top: 58.67,20.19 58.67,21.78 62.17,21.78 62.17,18.92 59.94,18.92
  pour Bottom: 47.56,34.99 60.58,34.99 60.58,38.16 47.56,38.16
  pour Top: 58.67,34.67 58.67,36.26 62.17,36.26 62.17,33.4 59.94,33.4
  pour Bottom: 47.37,23.75 23.11,23.75 23.11,15.88 44.32,15.88 44.32,20.57 47.37,20.57
VOUT_MOTOR  (via drill 0.76)
  Top 0.254: R8.2 50.71,41.34 74.68,41.34 78.51,38.01 L3.2 | C16.1 88.02,40.54 R10.2
  other vias: 93.34,36.96 93.34,38.61 93.34,35.31
  pour Top: 76.14,41.15 76.14,33.08 82.17,33.08 85.15,34.54 94.3,34.54 94.17,41.15
VSNS1_MOTOR
  Top 0.254: R8.1 R9.2 50.57,33.4 U$4.4
VSNS_5
  Top 0.254: R2.1 R3.2 50.57,18.92 U$2.4